# EasyEDA Pro project Step-down.eprj

# Schematic Schematic1
Board Name: Board1; Create Date: 2024-12-22; Page Name: P1; Project Name: Step-down; Schematic Name: Schematic1; Update Date: 2024-12-22; Add into BOM: yes; Company: 嘉立创EDA; Convert to PCB: yes; Page Size: A4; Version: V1.0
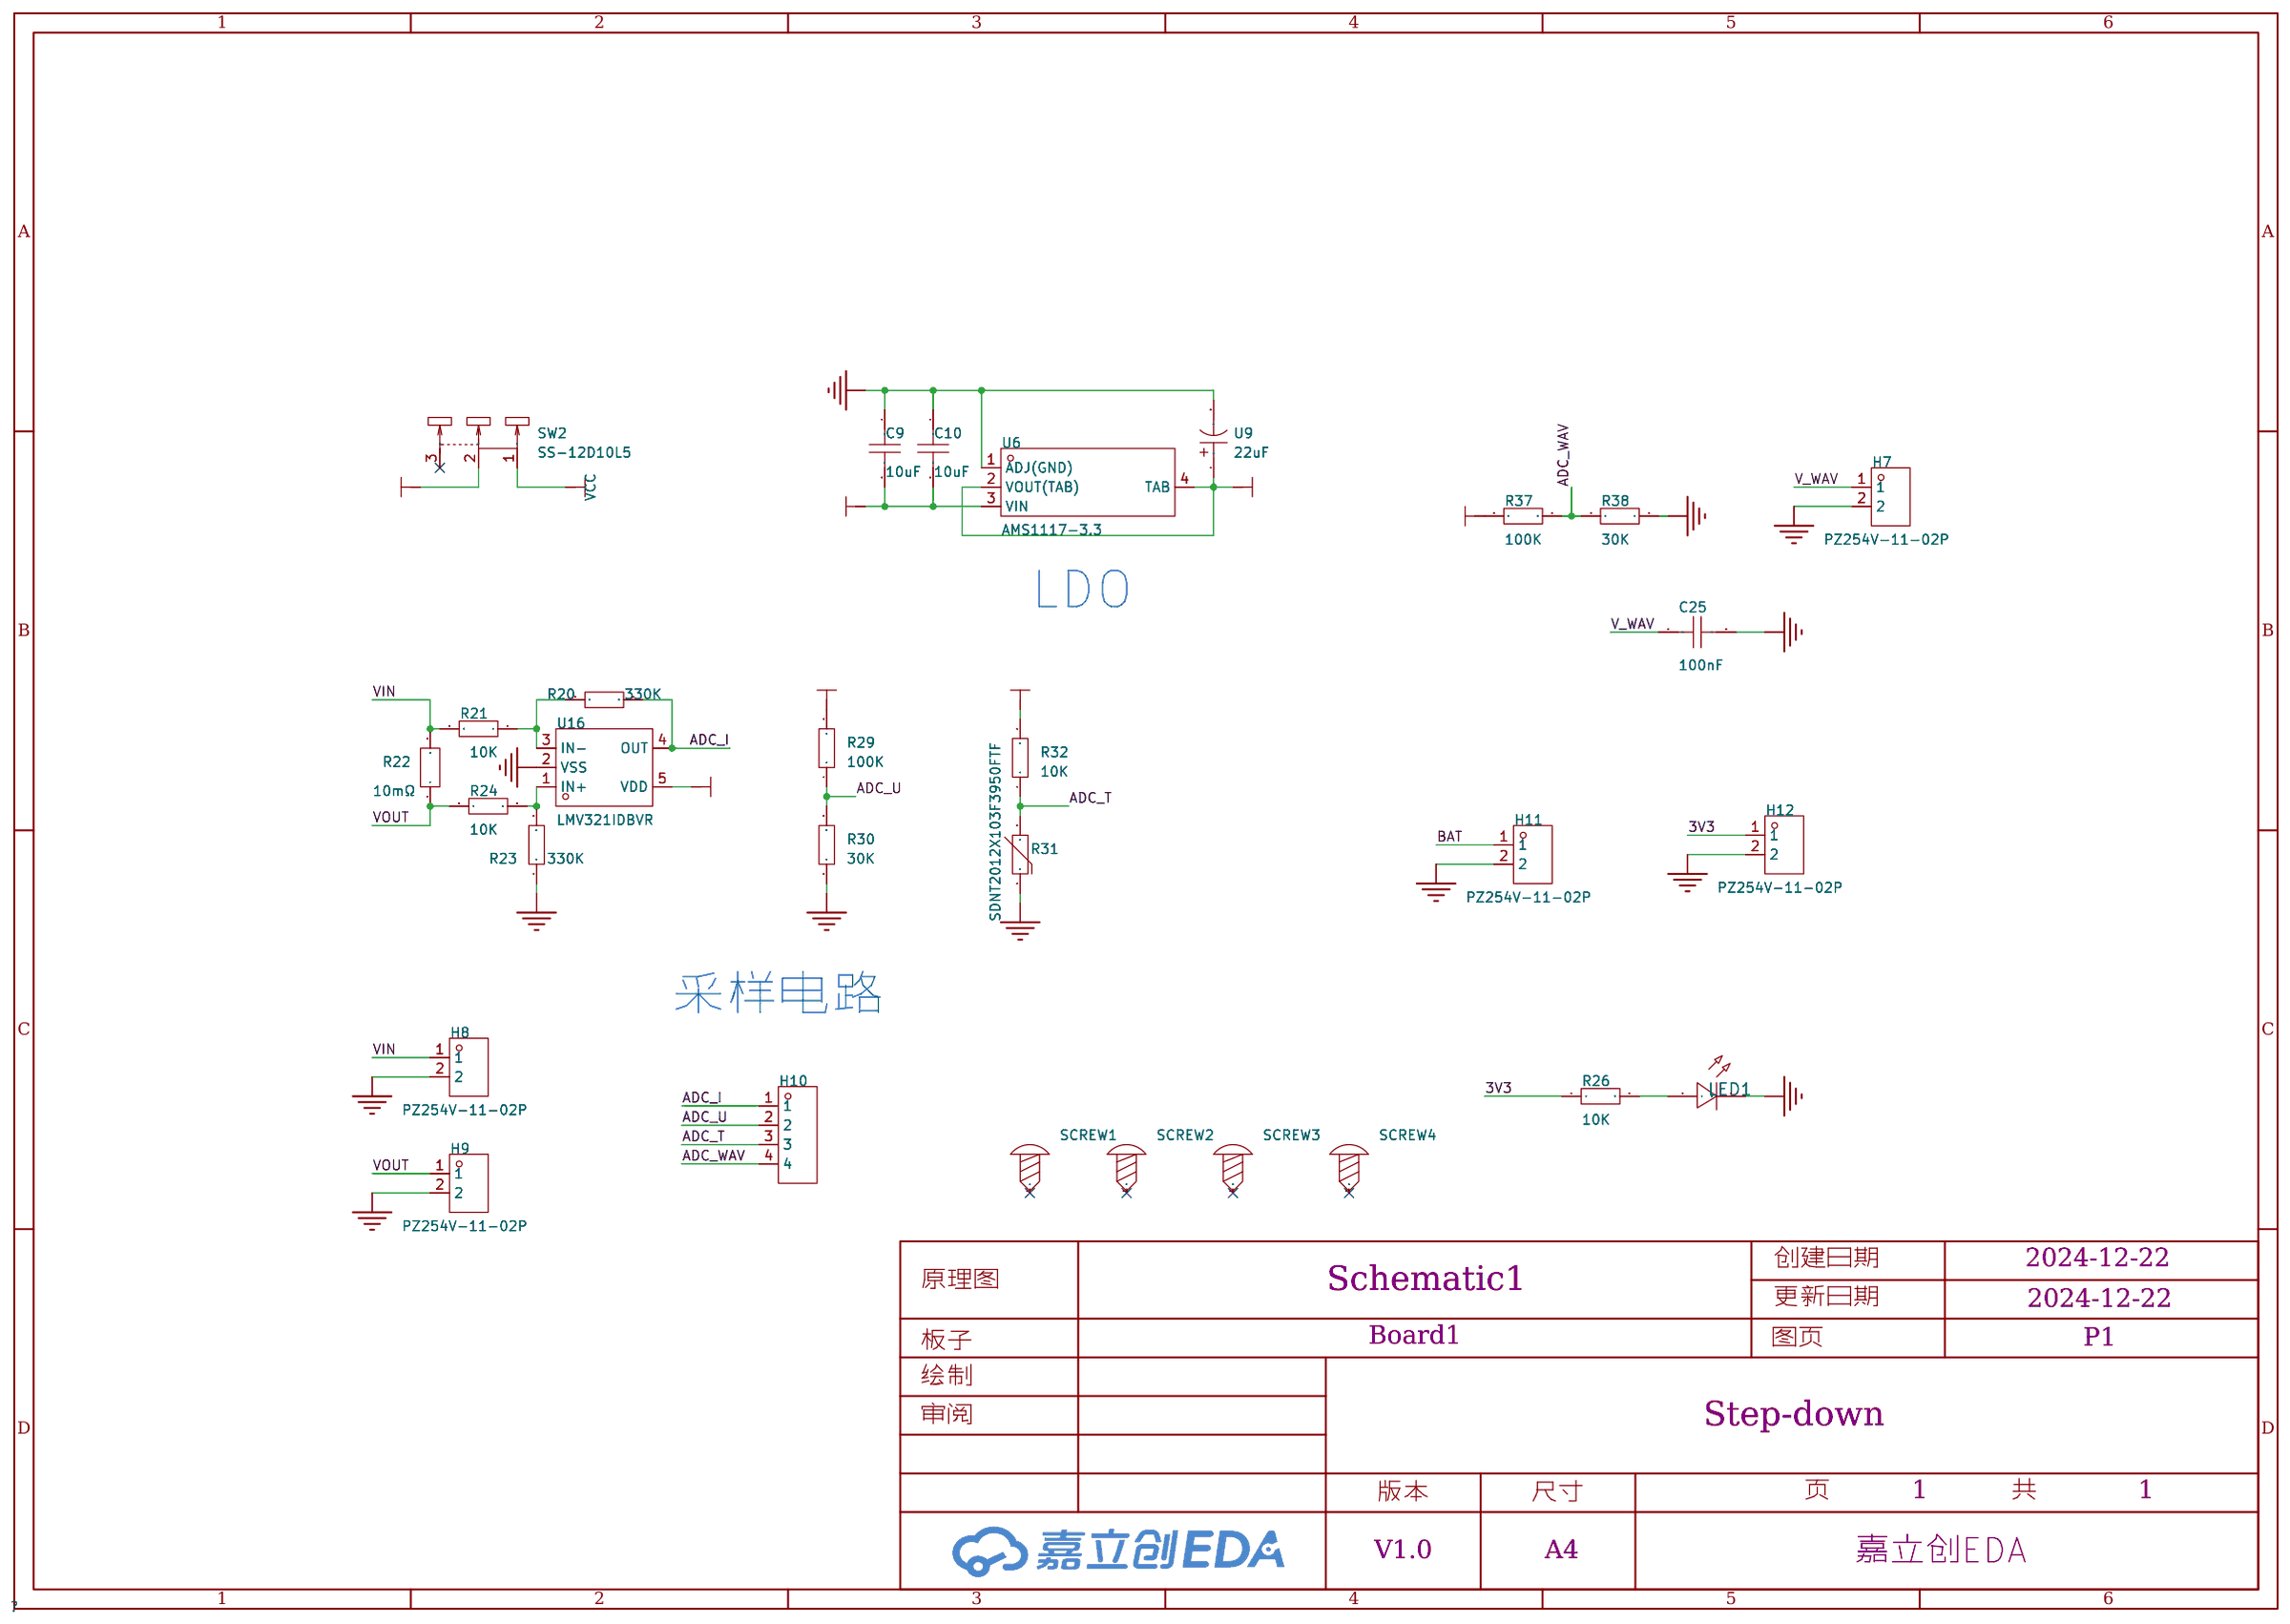
[diagram p0: schematic sheet]

## Parts
C9  10uF  [C0603]
C10  10uF  [C0603]
C25  100nF  [C0603]
H7  PZ254V-11-02P  [HDR-TH_2P-P2.54-V-M]
H8  PZ254V-11-02P  [HDR-TH_2P-P2.54-V-M]
H9  PZ254V-11-02P  [HDR-TH_2P-P2.54-V-M]
H10  -  [HDR-TH_4P-P2.54-V-F]
H11  PZ254V-11-02P  [HDR-TH_2P-P2.54-V-M]
H12  PZ254V-11-02P  [HDR-TH_2P-P2.54-V-M]
LED1  -  [LED_0603]
R20  330K  [R0603]
R21  10K  [R0603]
R22  10mΩ  [RES-SMD_L6.4-W3.2-1]
R23  330K  [R0603]
R24  10K  [R0603]
R26  10K  [R0603]
R29  100K  [R0603]
R30  30K  [R0603]
R31  SDNT2012X103F3950FTF  [R0805]
R32  10K  [R0603]
R37  100K  [R0603]
R38  30K  [R0603]
SCREW1  -  [M2螺丝]
SCREW2  -  [M2螺丝]
SCREW3  -  [M2螺丝]
SCREW4  -  [M2螺丝]
SW2  SS-12D10L5  [SW-TH_SS-12D10L5]
U6  AMS1117-3.3  [SOT-223-4_L6.5-W3.5-P2.30-LS7.0-BR]
U9  22uF  [CAP-SMD_L2.0-W1.3-FD]
U16  LMV321IDBVR  [SOT-23-5_L2.9-W1.6-P0.95-LS2.8-BR]

## Library data of the parts
C9 C10 C25 = CAP_0603: Supplier Footprint: 0603
H7-H9 H11 H12 = PZ254V-11-02P: 插针结构:1x2P;间距:2.54mm;行距:-;圆针/方针:方针;安装类型:直插;排数:单排;总PIN位数:2P;额定电流:-;额定电压:-;配合针长度:6mm;塑高:2.5mm;端接针长度:3mm;触头材质:黄铜;触头镀层:-;工作温度范围:-40℃~+105℃;颜色:黑色;; LCSC Part Name: 间距:2.54mm 1x2P 直插 方针; Supplier Part: C492401; Manufacturer: XFCN(兴飞); Supplier Footprint: 插件,P=2.54mm; JLCPCB Part Class: 扩展库; Datasheet: https://atta.szlcsc.com/upload/public/pdf/source/20200309/C492401_A812433581A9B211A7FFA413ADDFF0E5.pdf; Supplier: LCSC; Pin Structure: 1x2P; Pitch: 2.54mm; Circluar Pins/Square Pins: 方针; Mounting Type: 直插; Number of Rows: 单排; Number of Pins: 2P; Length of Mating Pin: 6mm; Insulation Height: 2.5mm; Length of End Connection Pin: 3mm; Contact Material: 黄铜; Operating Temperature Range: -40℃~+105℃; Color: 黑色
H10 = HDR-F_2.54_1x4P: Supplier Part: C2718488; Supplier Footprint: 插件
LED1 = LED_0603-R: Supplier Footprint: 0603
R20 R21 R23 R24 R26 R29 R30 R32 R37 R38 = Res_0603: Supplier Footprint: 0603
R22 = HoJLR2512-3W-5mR-1%: 电阻类型:采样电阻;阻值:5mΩ;精度:±1%;功率:3W;安装方式:贴片;; LCSC Part Name: 5mΩ ±1% 3W; Supplier Part: C2903482; Manufacturer: Milliohm(毫欧); Supplier Footprint: 2512; JLCPCB Part Class: 扩展库; Datasheet: https://atta.szlcsc.com/upload/public/pdf/source/20211009/7525CABAB363C979E942C1DD41F1FEF0.pdf; Supplier: LCSC; Type: 采样电阻; Tolerance: ±1%; Power(Watts): 3W; Mounting Sytle: 贴片
R31 = SDNT2012X103F3950FTF: 阻值(25℃):10kΩ;B值(25℃/50℃):3950K;电阻精度:±1%;功率:200mW;B值精度:±1%;最大稳态电流(25℃):440uA;; LCSC Part Name: 10kΩ 电阻精度:±1% 3950K; Supplier Part: C95968; Manufacturer: Sunlord(顺络); Supplier Footprint: 0805; JLCPCB Part Class: 扩展库; Datasheet: https://atta.szlcsc.com/upload/public/pdf/source/20210916/BF106A3565EDFEB141CB3E0EA3A661F8.pdf; Supplier: LCSC; Resistance @ 25℃: 10kΩ; B Constant (25℃/50℃): 3950K; Resistance Tolerance: ±1%; Power: 200mW; B Constant Tolerance: ±1%; Steady State Current (Max): 440uA; Operating Temperature: -55℃~+125℃
SCREW1-SCREW4 = M2螺丝: Supplier Footprint: 插件
SW2 = SS-12D10L5: 电路结构:单刀双掷;安装方式:直插;开关颜色:黑色;额定电流(DC):3A;额定电压(DC):125V;额定电流(AC):3A;额定电压(AC):125V;机械寿命:1万次;; LCSC Part Name: 柄长5mm 直插双档 滑动开关; Supplier Part: C319012; Manufacturer: XKB Connectivity(中国星坤); Supplier Footprint: 插件; JLCPCB Part Class: 扩展库; Datasheet: https://atta.szlcsc.com/upload/public/pdf/source/20211009/D6412F37AABE6F9459A6EE7FA4DAEADB.pdf; Supplier: LCSC; Circuit: 单刀双掷; Actuator Style: 矩形柱状; Pin Style: PC引脚; Switch Length: 13mm; Switch Width: 6.8mm; Switch Height: 6.4mm; Mounting Style: 直插; Actuator Color: 黑色; Current Rating (DC): 3A; Voltage Rating (DC): 125V; Current Rating (AC): 3A; Voltage Rating (AC): 125V; Mechanical Life: 1万次; Operating Temperature: -40℃~+85℃
U6 = AMS1117-3.3_C347222: 输出类型:固定;最大输入电压:18V;输出电压:3.3V;输出电流:1A;电源纹波抑制比(PSRR):60dB@(120Hz);输出极性:正极;; LCSC Part Name: 输出:3.3V 电流:1A 耐压:12V; Supplier Part: C347222; Manufacturer: UMW(友台半导体); Supplier Footprint: SOT-223; JLCPCB Part Class: 扩展库; Datasheet: https://atta.szlcsc.com/upload/public/pdf/source/20231109/155D79A26D9DB04352555A58D5969DC8.pdf; Supplier: LCSC; Output Type: 固定; Maximum Input Voltage: 18V; Output Voltage: 3.3V; Output Current: 1A; Power Supply Rejection Ratio (PSRR): 60dB@(120Hz); Dropout Voltage: 1.3V@(1A); Feature: 过流保护(OCP); Output Polarity: 正极; Number of Outputs: 1
U9 = TMCP0J226MTRF: 容值:22uF;精度:±20%;额定电压:6.3V;等效串联电阻:5.9Ω@100kHz;; LCSC Part Name: 22uF ±20% 6.3V; Supplier Part: C4983891; Manufacturer: VISHAY(威世); Supplier Footprint: 0805; JLCPCB Part Class: 扩展库; Datasheet: https://atta.szlcsc.com/upload/public/pdf/source/20231213/45DEC9D623A3BCD604D80B89FE3D1B4C.pdf; Supplier: LCSC; Tolerance: ±20%; Rated Voltage: 6.3V; Equivalent Series Resistance(ESR): 5.9Ω@100kHz; Operating Temperature: -55℃~+125℃
U16 = LMV321IDBVR_C3014306: 低功耗运放; Supplier Part: C3014306; Manufacturer: UMW(友台半导体); Supplier Footprint: SOT-23-5; JLCPCB Part Class: 扩展库; Datasheet: https://atta.szlcsc.com/upload/public/pdf/source/20231221/3CE86AED7262DC01AD69B40B1A503791.pdf; Supplier: LCSC

## Nets
3V3: H12.1 R26.1 R32.2 U6.2(VOUT(TAB)) U6.4(TAB) U9.1 U16.5(VDD)
GND: C9.1 C10.1 C25.2 H7.2 H8.2 H9.2 H11.2 H12.2 LED1.1(C) R23.1 R30.1 R31.1 R38.1 U6.1(ADJ(GND)) U9.2 U16.2(VSS)
VCC: C9.2 C10.2 SW2.1 U6.3(VIN)
VIN: H8.1 R21.2 R22.2 R29.2
ADC_I: H10.1 R20.1 U16.4(OUT)
ADC_T: H10.3 R31.2 R32.1
ADC_U: H10.2 R29.1 R30.2
ADC_WAV: H10.4 R37.1 R38.2
BAT: H11.1 SW2.2
V_WAV: C25.1 H7.1 R37.2
VOUT: H9.1 R22.1 R24.2
$1N764: R20.2 R21.1 U16.3(IN-)
$1N768: R23.2 R24.1 U16.1(IN+)
$1N1133: LED1.2(A) R26.2

Not connected (* = marked no-connect by the designer): SCREW1 1*; SCREW2 1*; SCREW3 1*; SCREW4 1*; SW2 3*

## Notes on the sheet
- LDO
- 采样电路

# Board PCB1
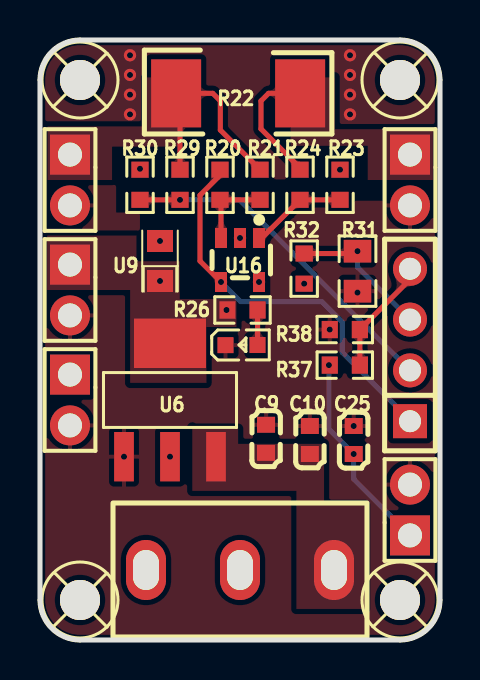
[diagram p1: board, top side]
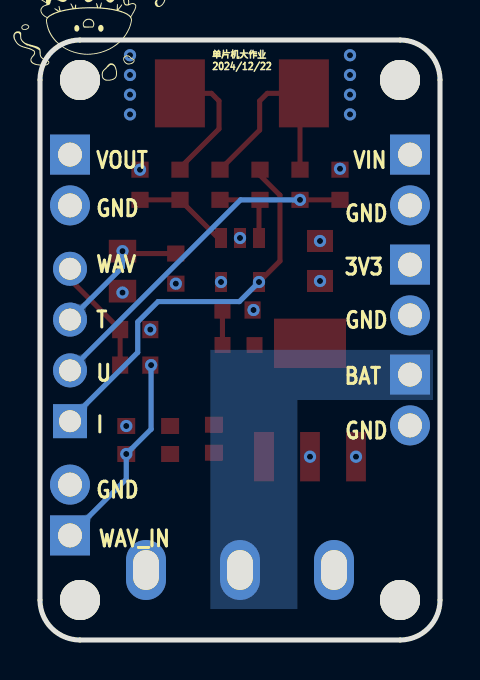
[diagram p2: board, bottom side, seen from below]

Outline 20 x 30 mm; copper layers: Top Layer, Inner1, Inner2, Bottom Layer. Coordinates in mm from the lower left corner of the outline.
Outline path: 0,28 0,2 arc(0.59,0.59) 2,0 18,0 arc(19.41,0.59) 20,2 20,28 arc(19.41,29.41) 18,30 2,30 arc(0.59,29.41) 0,28
Stack: Top Layer 0.035mm 外层铜厚1oz / Dielectric1 0.2104mm 7628 RC49% 8.6mil / Inner1 0.0152mm 内层铜厚 / Dielectric2 1.065mm 1.1mm H/HOZ Copper / Inner2 0.0152mm 内层铜厚 / Dielectric3 0.2104mm 7628 RC49% 8.6mil / Bottom Layer 0.035mm 外层铜厚1oz

## Design rules (mm)
template: JLCPCB Capability(Two Layers Board)
spacing copperThickness1oz (default): track to track 0.102, other pairs 0.152 to 0.3
spacing copperThickness2oz: track to track 0.203, other pairs 0.152 to 0.3
track width copperThickness1oz (default): min 0.127, default 0.254, max 2.54
track width copperThickness2oz: min 0.203, default 0.254, max 2.54
differential pair differentialPair (default): width min 0.127, default 0.254, max 2.54; gap min 0.152, default 0.152
via viaSize (default): diameter min 0.5, default 0.61, max 10; hole min 0.3, default 0.305, max 6.3

## Placement (name value [footprint] x y rotation side)
C9  10uF  [C0603]  11.3 10.06 270 top
C10  10uF  [C0603]  13.49 10 270 top
C25  100nF  [C0603]  15.69 10 90 top
H7  PZ254V-11-02P  [HDR-TH_2P-P2.54-V-M]  18.5 6.5 90 top
H8  PZ254V-11-02P  [HDR-TH_2P-P2.54-V-M]  1.5 23 270 top
H9  PZ254V-11-02P  [HDR-TH_2P-P2.54-V-M]  18.5 23 270 top
H10  -  [HDR-TH_4P-P2.54-V-F]  18.5 14.75 90 top
H11  PZ254V-11-02P  [HDR-TH_2P-P2.54-V-M]  1.5 12 270 top
H12  PZ254V-11-02P  [HDR-TH_2P-P2.54-V-M]  1.5 17.5 270 top
LED1  -  [LED_0603]  10.12 14.75 0 top
R20  330K  [R0603]  9 22.76 270 top
R21  10K  [R0603]  11 22.76 90 top
R22  10mΩ  [RES-SMD_L6.4-W3.2-1]  9.91 27.33 180 top
R23  330K  [R0603]  15 22.76 270 top
R24  10K  [R0603]  13 22.76 90 top
R26  10K  [R0603]  10.12 16.5 0 top
R29  100K  [R0603]  7 22.76 90 top
R30  30K  [R0603]  5 22.76 270 top
R31  SDNT2012X103F3950FTF  [R0805]  15.88 18.44 90 top
R32  10K  [R0603]  13.21 18.57 270 top
R37  100K  [R0603]  15.24 13.74 180 top
R38  30K  [R0603]  15.24 15.52 0 top
SCREW1  -  [M2螺丝]  2 28 0 top
SCREW2  -  [M2螺丝]  18 28 0 top
SCREW3  -  [M2螺丝]  2 2 0 top
SCREW4  -  [M2螺丝]  18 2 0 top
SW2  SS-12D10L5  [SW-TH_SS-12D10L5]  10 3.5 180 top
U6  AMS1117-3.3  [SOT-223-4_L6.5-W3.5-P2.30-LS7.0-BR]  6.5 12 270 top
U9  22uF  [CAP-SMD_L2.0-W1.3-FD]  6 18.95 90 top
U16  LMV321IDBVR  [SOT-23-5_L2.9-W1.6-P0.95-LS2.8-BR]  10 19 90 top

## Footprints (pads in the part's own frame, mm; a bottom-side part is the same pattern mirrored in y, then rotated)
C0603
  rect 0.8x0.9 smd: 1(-0.7,0) 2(0.7,0)
CAP-SMD_L2.0-W1.3-FD
  rect 1.1x1.3 smd: 1(-1,0) 2(1,0)
HDR-TH_2P-P2.54-V-M
  rect 2x2 hole 1.2: 1(-1.27,0)
  round 2 hole 1.2: 2(1.27,0)
HDR-TH_4P-P2.54-V-F
  rect 1.7x1.7 hole 1.1: 1(-3.81,0)
  round 1.7 hole 1.1: 2(-1.27,0) 3(1.27,0) 4(3.81,0)
LED_0603
  rect 0.8x0.8 smd: 1(-0.851,-0.01) 2(0.75,-0.005)
M2螺丝
  round 2 hole 2: 1(0,0)
R0603
  rect 0.806x0.864 smd: 1(-0.753,0) 2(0.753,0)
R0805
  rect 1.133x1.377 smd: 1(-1,0) 2(1,0)
RES-SMD_L6.4-W3.2-1
  rect 2.5x3.4 smd: 1(-3.1,0) 2(3.1,0)
SOT-23-5_L2.9-W1.6-P0.95-LS2.8-BR
  rect 1x0.6 smd: 1(1.1,-0.95) 2(1.1,0) 3(1.1,0.95) 4(-1.1,0.95) 5(-1.1,-0.95)
SOT-223-4_L6.5-W3.5-P2.30-LS7.0-BR
  rect 2.47x0.98 smd: 1(2.835,-2.3) 2(2.835,0) 3(2.835,2.3)
  rect 2.47x3.6 smd: 4(-2.835,0)
SW-TH_SS-12D10L5
  oval 2x3 hole 1.3x2: 1(-4.7,0) 2(0,0) 3(4.7,0)

## Nets
As in the schematic.

Pads without a net: SCREW1 1; SCREW2 1; SCREW3 1; SCREW4 1; SW2 3

## Via types
v1: diameter 0.61, hole 0.305, Top Layer to Bottom Layer, 26 vias

## Routing (per net, layer and track width the routed paths; a pad name or vN(x,y) marks a point on that pad's centre or on a via; arc(x,y) is an arc through that point)
3V3:
  vias: v1(6,17.95) v1(6.5,9.17) v1(9.32,16.5) v1(10.95,17.9) v1(13.21,17.82)
GND:
  vias: v1(4.2,9.17) v1(4.5,29.24) v1(4.5,28.25) v1(4.5,27.27) v1(4.5,26.28) v1(5,23.56) v1(6,19.95) v1(10,20.1) v1(14.49,15.52) v1(15,23.51) v1(15.5,29.24) v1(15.5,28.25) v1(15.5,27.27) v1(15.5,26.28) v1(15.69,10.7) v1(15.88,17.37)
VIN: length 10.5
  Top Layer w0.254: R21.2 9.02,25.5 9.02,26.95 8.64,27.33 R22.2 7,27.14 R29.2
ADC_I: length 19.7
  Top Layer w0.254: R20.1 9,23.24 8,22.24 8,18.95 v1(9.05,17.9)
  Bottom Layer w0.254: v1(9.05,17.9) 10.03,16.92 14.1,16.92 15.11,15.9 15.11,14.38 18.5,10.99 H10.1
ADC_T: length 7.2
  Top Layer w0.254: v1(15.88,19.44) 15.76,19.32 R32.1
  Bottom Layer w0.254: v1(15.88,19.44) 15.88,18.64 H10.3
ADC_U: length 17
  Top Layer w0.254: R30.2 v1(7,22.01)
  Bottom Layer w0.254: H10.2 9.97,22.01 v1(7,22.01)
ADC_WAV: length 5.9
  Top Layer w0.254: H10.4 18.5,18.03 R38.2 R37.1
V_WAV: length 10.2
  Bottom Layer w0.254: v1(14.44,13.74) 14.44,10.54 v1(15.69,9.3) 15.69,8.04 H7.1
VOUT: length 6.4
  Top Layer w0.254: R24.2 13,23.6 11.05,25.56 11.05,26.95 11.43,27.33 R22.1
$1N764: length 3.9
  Top Layer w0.254: U16.3 9.05,21.96 R20.2 R21.1
$1N768: length 4.8
  Top Layer w0.254: R23.2 R24.1 11.09,20.1 U16.1
$1N1133: length 1.8
  Top Layer w0.254: 10.87,14.75 10.88,14.75 R26.2

## Copper pours and planes (outline as drawn; the poured copper is in the pictures)
3V3 on Top Layer: 0.36,20.22 9.82,20.22 9.82,12.86 0.36,12.86
3V3 on Inner2: 0.26,29.74 19.74,29.74 19.74,0.26 0.26,0.26
GND on Top Layer: -1.52,31.27 24.13,31.27 24.13,-1.11 -1.52,-1.11
GND on Bottom Layer: -2.92,32.41 26.8,32.41 26.8,-3.15 -2.92,-3.15
GND on Inner1: 0.26,29.74 19.74,29.74 19.74,0.26 0.26,0.26
VCC on Top Layer: 7.61,10.63 16.26,10.63 16.26,1.55 7.61,1.55
VIN on Top Layer: 0.38,28.14 7.13,28.14 7.13,23 0.38,23
BAT on Bottom Layer: 0.36,14.51 11.48,14.51 11.48,1.55 0.36,1.55
VOUT on Top Layer: 12.53,28.14 19.64,28.14 19.64,23 12.53,23

Small or netless copper shapes (teardrops, artwork), in the pictures only: 29 on Top Layer, 10 on Bottom Layer, 10 on Inner1, 2 on Inner2

## Text on the board
Bottom Silkscreen Layer: VIN | GND | 3V3 | BAT | WAV_IN | VOUT | T | U | I | WAV | 单片机大作业 / 2024/12/22
